# Altium project 28Pins_Arduino.PrjPcb
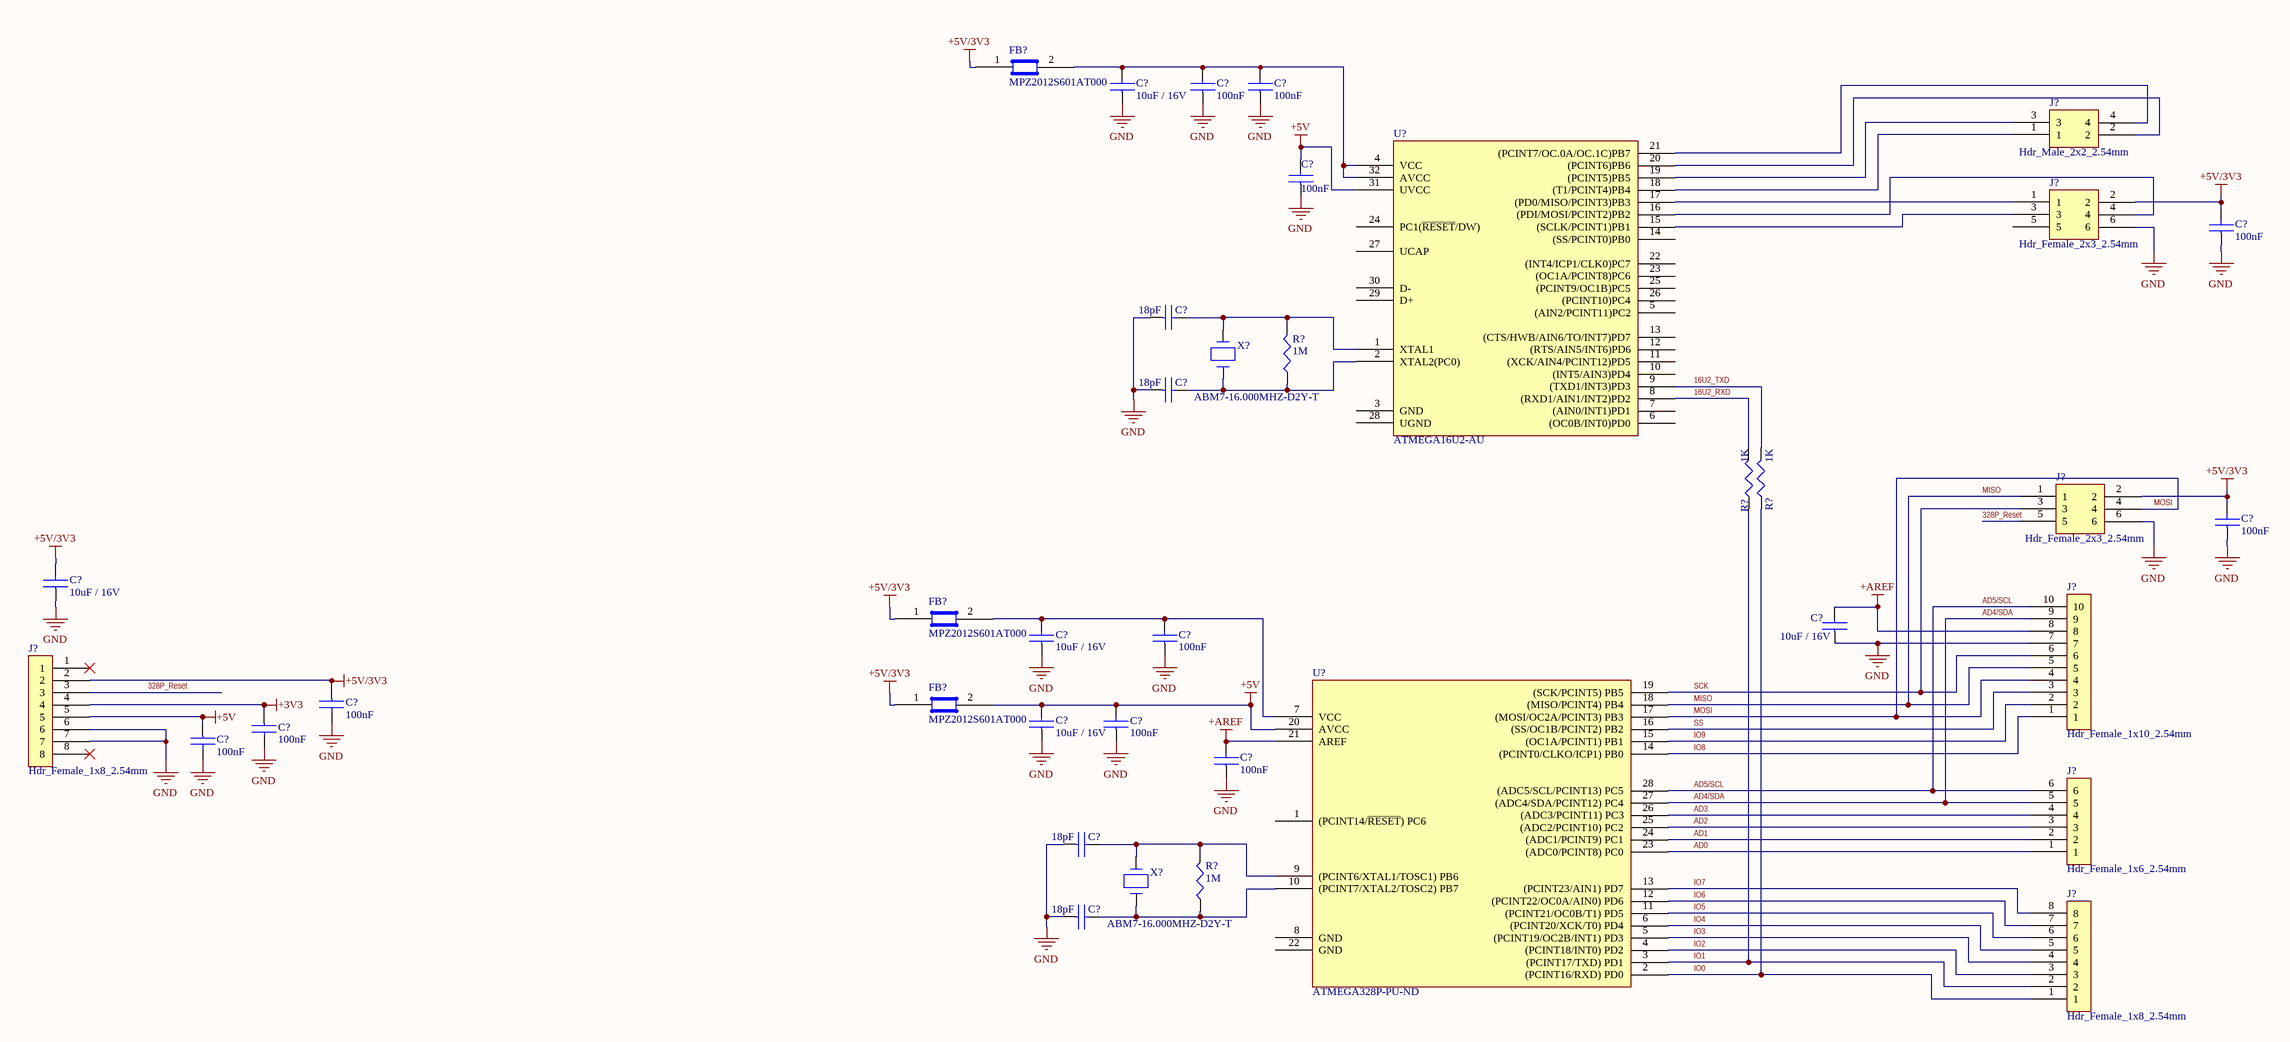
[diagram p0: 28Pins_Arduino_Schematic.SchDoc]
1 sheet, 38 parts. Net scope: global (net labels, ports and power ports of the same name join across sheets).
Board file: 28Pins_Arduino_PCB.PcbDoc

## Sheet 28Pins_Arduino_Schematic.SchDoc: 28-Pins
size A2; SheetNumber: 1; SheetTotal: 1

### Parts
(Parts that share a designator on the sheet are numbered #1, #2 ... from top to bottom, then left to right.)
C?#1  100nF  [C0805]
C?#2  100nF  [C0805]
C?#3  10uF / 16V  [C0805]
C?#4  100nF  [C0805]
C?#5  100nF  [C0805]
C?#6  18pF  [C0805]
C?#7  18pF  [C0805]
C?#8  100nF  [C0805]
C?#9  10uF / 16V  [C0805]
C?#10  100nF  [C0805]
C?#11  10uF / 16V  [C0805]
C?#12  10uF / 16V  [C0805]
C?#13  100nF  [C0805]
C?#14  100nF  [C0805]
C?#15  10uF / 16V  [C0805]
C?#16  100nF  [C0805]
C?#17  100nF  [C0805]
C?#18  100nF  [C0805]
C?#19  18pF  [C0805]
C?#20  18pF  [C0805]
FB?#1  MPZ2012S601AT000  [C0805]
FB?#2  MPZ2012S601AT000  [C0805]
FB?#3  MPZ2012S601AT000  [C0805]
J?#1  Hdr_Male_2x2_2.54mm  [Hdr_Male_2x2_2.54mm]
J?#2  Hdr_Female_2x3_2.54mm  [Hdr_Male_2x3_2.54mm]
J?#3  Hdr_Female_2x3_2.54mm  [Hdr_Male_2x3_2.54mm]
J?#4  Hdr_Female_1x8_2.54mm  [Hdr_Female_1x8_2.54mm]
J?#5  Hdr_Female_1x10_2.54mm  [Hdr_Female_1x10_2.54mm]
J?#6  Hdr_Female_1x6_2.54mm  [Hdr_Female_1x6_2.54mm]
J?#7  Hdr_Female_1x8_2.54mm  [Hdr_Female_1x8_2.54mm]
R?#1  1M  [R0805]
R?#2  1K  [R0805]
R?#3  1K  [R0805]
R?#4  1M  [R0805]
U?#1  ATMEGA16U2-AU  [32_TQFP_0.8mm]
U?#2  ATMEGA328P-PU-ND  [28_DIP_7.62mm]
X?#1  ABM7-16.000MHZ-D2Y-T  [ABM7_v1_1_Big]
X?#2  ABM7-16.000MHZ-D2Y-T  [ABM7_v1_1_Big]

### Nets
+3V3: C?#17.1 J?#4.4
+5V: C?#4.2 C?#13.2 C?#15.2 C?#18.1 FB?#3.2 J?#4.5 U?#1.31(UVCC) U?#2.20(AVCC)
+5V/3V3: C?#5.2 C?#8.2 C?#9.2 C?#14.1 FB?#1.1 FB?#2.1 FB?#3.1 J?#2.2 J?#3.2 J?#4.2
+AREF: C?#11.2 C?#16.2 J?#5.8 U?#2.21(AREF)
GND: C?#1.1 C?#2.1 C?#3.1 C?#4.1 C?#5.1 C?#6.1 C?#7.1 C?#8.1 C?#9.1 C?#10.1 C?#11.1 C?#12.1 C?#13.1 C?#14.2 C?#15.1 C?#16.1 C?#17.2 C?#18.2 C?#19.1 C?#20.1 J?#2.6 J?#3.6 J?#4.6 J?#4.7 J?#5.7
16U2_RXD: R?#2.2 U?#1.8((RXD1/AIN1/INT2)PD2)
16U2_TXD: R?#3.2 U?#1.9((TXD1/INT3)PD3)
328P_Reset: J?#3.5 J?#4.3
AD0: J?#6.1 U?#2.23((ADC0/PCINT8)_PC0)
AD1: J?#6.2 U?#2.24((ADC1/PCINT9)_PC1)
AD2: J?#6.3 U?#2.25((ADC2/PCINT10)_PC2)
AD3: J?#6.4 U?#2.26((ADC3/PCINT11)_PC3)
AD4/SDA: J?#5.9 J?#6.5 U?#2.27((ADC4/SDA/PCINT12)_PC4)
AD5/SCL: J?#5.10 J?#6.6 U?#2.28((ADC5/SCL/PCINT13)_PC5)
IO0: J?#7.1 R?#3.1 U?#2.2((PCINT16/RXD)_PD0)
IO1: J?#7.2 R?#2.1 U?#2.3((PCINT17/TXD)_PD1)
IO2: J?#7.3 U?#2.4((PCINT18/INT0)_PD2)
IO3: J?#7.4 U?#2.5((PCINT19/OC2B/INT1)_PD3)
IO4: J?#7.5 U?#2.6((PCINT20/XCK/T0)_PD4)
IO5: J?#7.6 U?#2.11((PCINT21/OC0B/T1)_PD5)
IO6: J?#7.7 U?#2.12((PCINT22/OC0A/AIN0)_PD6)
IO7: J?#7.8 U?#2.13((PCINT23/AIN1)_PD7)
IO8: J?#5.1 U?#2.14((PCINT0/CLKO/ICP1)_PB0)
IO9: J?#5.2 U?#2.15((OC1A/PCINT1)_PB1)
MISO: J?#3.1 J?#5.5 U?#2.18((MISO/PCINT4)_PB4)
MOSI: J?#3.4 J?#5.4 U?#2.17((MOSI/OC2A/PCINT3)_PB3)
SCK: J?#3.3 J?#5.6 U?#2.19((SCK/PCINT5)_PB5)
SS: J?#5.3 U?#2.16((SS/OC1B/PCINT2)_PB2)
NetC?#1_2: C?#1.2 C?#2.2 C?#3.2 FB?#1.2 U?#1.4(VCC) U?#1.32(AVCC)
NetC?#6_2: C?#6.2 R?#1.2 U?#1.1(XTAL1) X?#1.2
NetC?#7_2: C?#7.2 R?#1.1 U?#1.2(XTAL2(PC0)) X?#1.1
NetC?#10_2: C?#10.2 C?#12.2 FB?#2.2 U?#2.7(VCC)
NetC?#19_2: C?#19.2 R?#4.2 U?#2.9((PCINT6/XTAL1/TOSC1)_PB6) X?#2.2
NetC?#20_2: C?#20.2 R?#4.1 U?#2.10((PCINT7/XTAL2/TOSC2)_PB7) X?#2.1
NetJ?#1_1: J?#1.1 U?#1.18((T1/PCINT4)PB4)
NetJ?#1_2: J?#1.2 U?#1.20((PCINT6)PB6)
NetJ?#1_3: J?#1.3 U?#1.19((PCINT5)PB5)
NetJ?#1_4: J?#1.4 U?#1.21((PCINT7/OC.0A/OC.1C)PB7)
NetJ?#2_1: J?#2.1 U?#1.17((PD0/MISO/PCINT3)PB3)
NetJ?#2_3: J?#2.3 U?#1.15((SCLK/PCINT1)PB1)
NetJ?#2_4: J?#2.4 U?#1.16((PDI/MOSI/PCINT2)PB2)

Not connected (* = marked no-connect by the designer): J?#2 5; J?#4 1* 8*; U?#1 3(GND) 5((AIN2/PCINT11)PC2) 6((OC0B/INT0)PD0) 7((AIN0/INT1)PD1) 10((INT5/AIN3)PD4) 11((XCK/AIN4/PCINT12)PD5) 12((RTS/AIN5/INT6)PD6) 13((CTS/HWB/AIN6/TO/INT7)PD7) 14((SS/PCINT0)PB0) 22((INT4/ICP1/CLK0)PC7) 23((OC1A/PCINT8)PC6) 24(PC1(~{RESET}/DW)) 25((PCINT9/OC1B)PC5) 26((PCINT10)PC4) 27(UCAP) 28(UGND) 29(D+) 30(D-); U?#2 1((PCINT14/~{RESET})_PC6) 8(GND) 22(GND)

### Library data of the parts
C?#1 C?#2 C?#4 C?#5 C?#8 C?#10 C?#13 C?#14 C?#16-C?#18 = C2012X7R1H104K085AA: TDK - C2012X7R1H104K085AA - Keramikvielschichtkondensator, SMD, 0.1 µF, 50 V, 0805 [Metrisch 2012], ± 10%, X7R, C Series TDK; PCN Part Number: MLCC Part Number Change 30/Nov/2012; Product Training Modules: C Series General Applications SEAT, CCV, and TVCL Design Tools Guide to Replacing an Electrolytic Capacitor with an MLCC; Capacitance: 0.1µF; Voltage - Rated: 50V; Online Catalog: C Series, General Purpose; Kits: 445-9015-KIT-ND  - KIT MLCC 1000PF-47UF 0805 10-50V; Other Names: 445-7534-1; Supplier 1: Digi-Key; Manufacturer: TDK; Manufacturer Part Number: C2012X7R1H104K085AA; Stock 1: 307688; Pricing 1: 1=0.17, 10=0.119, 100=0.0561, 500=0.0394, 1000=0.0326 (USD); RoHS Information: RoHS Certificate-MLCC; Standard Package: 1; Category: Capacitors; Family: Ceramic Capacitors; Series: C; Packaging: Cut Tape (CT); Tolerance: ±10%; Temperature Coefficient: X7R; Mounting Type: Surface Mount, MLCC; Operating Temperature: -55°C ~ 125°C; Applications: General Purpose; Ratings: -; Package / Case: 0805 (2012 Metric); Size / Dimension: 0.079" L x 0.049" W (2.00mm x 1.25mm); Height - Seated (Max): -; Thickness (Max): 0.037" (0.95mm); Lead Spacing: -; Features: -; Lead Style: -; ComponentLink1URL: http://uk.rs-online.com/webdocs/1532/0900766b81532cd0.pdf?src-supplier=RSComponents; ComponentLink1Description: http://uk.rs-online.com/webdocs/1532/0900766b81532cd0.pdf?src-supplier=RSComponents; ComponentLink2URL: https://product.tdk.com/info/en/catalog/datasheets/mlcc_commercial_general_en.pdf?src-supplier=Digi-Key; ComponentLink2Description: https://product.tdk.com/info/en/catalog/datasheets/mlcc_commercial_general_en.pdf?src-supplier=Digi-Key; ComponentLink3URL: http://www.tdk.co.jp/tefe02/e412_c.pdf?src-supplier=Future+Electronics; ComponentLink3Description: http://www.tdk.co.jp/tefe02/e412_c.pdf?src-supplier=Future+Electronics; ComponentLink4URL: http://www.farnell.com/datasheets/1796654.pdf?src-supplier=Newark; ComponentLink4Description: http://www.farnell.com/datasheets/1796654.pdf?src-supplier=Newark; ComponentLink5URL: http://www.farnell.com/datasheets/1571323.pdf?src-supplier=Element14; ComponentLink5Description: http://www.farnell.com/datasheets/1571323.pdf?src-supplier=Element14; Supplier Part Number 1: 445-7534-1-ND
C?#3 C?#9 C?#11 C?#12 C?#15 = C2012X5R1C106M125AC: CERAMIC CAPACITOR, 10UF, 16V, X5R, 20%, 0805, FULL REEL; Product Range:C Series; Capacitance:10 F; Capacitance Tolerance: 20%; Dielectric Characteristic:X5R; Voltage Rating:16V; Ceramic Capacitor Case:0805 [2012 Metric]; MSL:- ;RoHS Compliant: Yes; Manufacturer: TDK; PCN Part Number: MLCC Part Number Change 30/Nov/2012; Product Training Modules: C Series General Applications SEAT, CCV, and TVCL Design Tools Guide to Replacing an Electrolytic Capacitor with an MLCC; Catalog Drawings: C SERIES_2012-0805_1.45; Capacitance: 10µF; Online Catalog: C Series, General Purpose; Other Names: 445-4115-2 C2012X5R1C106M C2012X5R1C106M/1.25 C2012X5R1C106MT C2012X5R1C106MTJ00E; Supplier 1: Digi-Key; Manufacturer Part Number: C2012X5R1C106M125AC; Stock 1: 0; RoHS Information: RoHS Certificate-MLCC; Standard Package: 2,000; Category: Capacitors; Family: Ceramic Capacitors; Series: C; Packaging: Tape & Reel (TR); Tolerance: ±20%; Voltage - Rated: 16V; Temperature Coefficient: X5R; Mounting Type: Surface Mount, MLCC; Operating Temperature: -55°C ~ 85°C; Applications: General Purpose; Ratings: -; Package / Case: 0805 (2012 Metric); Size / Dimension: 0.079" L x 0.049" W (2.00mm x 1.25mm); Height - Seated (Max): -; Thickness (Max): 0.057" (1.45mm); Lead Spacing: -; Features: -; Lead Style: -; ComponentLink1URL: https://media.digikey.com/pdf/Data%20Sheets/TDK%20PDFs/Multilayer%20Ceramic%20Chip%20Cap(up%20to%2050V).pdf?src-supplier=Digi-Key; ComponentLink1Description: https://media.digikey.com/pdf/Data%20Sheets/TDK%20PDFs/Multilayer%20Ceramic%20Chip%20Cap(up%20to%2050V).pdf?src-supplier=Digi-Key; ComponentLink2URL: http://www.farnell.com/datasheets/1913358.pdf?src-supplier=Element14; ComponentLink2Description: http://www.farnell.com/datasheets/1913358.pdf?src-supplier=Element14; ComponentLink3URL: https://product.tdk.com/info/en/documents/chara_sheet/C2012X5R1C106M125AC.pdf?src-supplier=Newark; ComponentLink3Description: https://product.tdk.com/info/en/documents/chara_sheet/C2012X5R1C106M125AC.pdf?src-supplier=Newark; Supplier Part Number 1: 445-4115-2-ND
C?#6 C?#7 C?#19 C?#20 = C0805C180K5GACTU: KEMET - C0805C180K5GACTU - SMD Multilayer Ceramic Capacitor, 18 pF, 50 V, 0805 [2012 Metric], ± 10%, C0G / NP0, C Series KEMET; Part # Aliases: C0805C180K5GAC7800; Case Height: 0.78 mm; Case Length: 2 mm; Dielectric: C0G (NP0); Case Width: 1.2 mm; Class: Class 1; Dissipation Factor DF: 0.1; Voltage Rating: 50 V; Temperature Coefficient / Code: +/- 30 PPM / C; Type: SMD MLCC C0G 10 - 250 VDC Commercial Grade; Supplier 1: Digi-Key; Manufacturer: KEMET; Manufacturer Part Number: C0805C180K5GACTU; Stock 1: 42877; Pricing 1: 1=0.12, 10=0.09, 100=0.0403, 500=0.0288, 1000=0.0226 (USD); Brand: Kemet; Capacitance: 18 pF; Case Code - in: 0805; Case Code - mm: 2012; Dimensions: 1.2 mm W x 2 mm L x 0.78 mm H; Lead Spacing: 0.75 mm; Factory Pack Quantity: 4000; Product Category: Multilayer Ceramic Capacitors MLCC - SMD/SMT; RoHS: Details; Voltage Rating DC: 50 V; Tolerance: 10 %; Minimum Operating Temperature: - 55 C; Maximum Operating Temperature: + 125 C; Product: General Type MLCCs; Operating Temperature Range: - 55 C to + 125 C; Package / Case: 0805 (2012 metric); Packaging: Reel; Series: C0805C; Termination Style: SMD/SMT; ComponentLink1URL: https://www.verical.com/server-webapp/html/getDatasheet?partID=742486&src-supplier=Verical; ComponentLink1Description: https://www.verical.com/server-webapp/html/getDatasheet?partID=742486&src-supplier=Verical; ComponentLink2URL: http://www.mouser.com/ds/2/212/KEM_C1003_C0G_SMD-1101588.pdf?src-supplier=Mouser; ComponentLink2Description: http://www.mouser.com/ds/2/212/KEM_C1003_C0G_SMD-1101588.pdf?src-supplier=Mouser; Supplier Part Number 1: 399-8030-1-ND
FB?#1-FB?#3 = MPZ2012S601AT000: FERRITE BEAD 600 OHM 0805 1LN; Manufacturer: TDK; PCN Part Number: MMZ,MPS Series Oct/2014; Product Training Modules: EMC Components; Catalog Drawings: (MMZ,MPZ)2012 Series Top / (MMZ,MPZ)2012 Series Footprint / (MMZ,MPZ)2012 Series Side; Impedance @ Frequency: 600 Ohm @ 100MHz; Current Rating: 2A; DC Resistance (DCR): 100 mOhm Max; Filter Type: Differential Mode - Single; Online Catalog: MPZ2012 Series; Other Names: 445-2206-6; Supplier 1: Digi-Key; Manufacturer Part Number: MPZ2012S601AT000; Stock 1: 133386; Pricing 1: 1=0.11, 10=0.091, 25=0.0704, 50=0.0584, 100=0.0503, 250=0.0403, 500=0.0362, 1000=0.0302 (USD); Standard Package: 1; Category: Filters; Family: Ferrite Beads and Chips; Series: MPZ; Packaging: Digi-Reel®; Package / Case: 0805 (2012 Metric); Mounting Type: Surface Mount; Height (Max): 0.041" (1.05mm); Size / Dimension: 0.079" L x 0.049" W (2.00mm x 1.25mm); ComponentLink1URL: https://media.digikey.com/pdf/Data%20Sheets/TDK%20PDFs/MPZ_Series_Br.pdf?src-supplier=Digi-Key; ComponentLink1Description: https://media.digikey.com/pdf/Data%20Sheets/TDK%20PDFs/MPZ_Series_Br.pdf?src-supplier=Digi-Key; ComponentLink2URL: https://product.tdk.com/info/en/catalog/datasheets/beads_commercial_power_mpz2012_en.pdf?src-supplier=Digi-Key; ComponentLink2Description: https://product.tdk.com/info/en/catalog/datasheets/beads_commercial_power_mpz2012_en.pdf?src-supplier=Digi-Key; Supplier Part Number 1: 445-2206-6-ND
J?#1 = Hdr_Male_2x2_2.54mm - M20-9760246: 2 x 2 male header; Manufacturer: Harwin; Number of Positions / Contacts: 4; Pitch: 2.54 mm; Mounting Angle: Vertical; Current Rating: 3 A; Voltage Rating: 750 V; Description: 02+02 DIL Vert Pin Hdr; Supplier 1: Digi-Key; Manufacturer Part Number: M20-9760246; Stock 1: 8632; Pricing 1: 1=0.19, 10=0.179, 100=0.1102, 500=0.0912, 1000=0.0798, 5000=0.0684, 10000=0.0665 (USD); Mounting Style: Panel; Product Category: Headers & Wire Housings; RoHS: Details; Brand: Harwin; Series: M20; Product Type: Headers; Type: Pin Strip; Number of Positions: 4; Number of Rows: 2; Contact Plating: Tin; Housing Material: Nylon; Termination Style: Through Hole; Factory Pack Quantity: 1000; ComponentLink1URL: https://cdn.harwin.com/pdfs/Harwin_PC_Connectors_M20.pdf?src-supplier=Digi-Key; ComponentLink1Description: https://cdn.harwin.com/pdfs/Harwin_PC_Connectors_M20.pdf?src-supplier=Digi-Key; ComponentLink2URL: http://components.arrow.com/part/dataview/0323_00724419?src-supplier=Arrow+Europe; ComponentLink2Description: http://components.arrow.com/part/dataview/0323_00724419?src-supplier=Arrow+Europe; ComponentLink3URL: http://www.mouser.com/ds/2/181/Harwin_Product_Catalog_page_207-1131241.pdf?src-supplier=Mouser; ComponentLink3Description: http://www.mouser.com/ds/2/181/Harwin_Product_Catalog_page_207-1131241.pdf?src-supplier=Mouser; Supplier Part Number 1: 952-1772-ND
J?#2 J?#3 = Hdr_Female_2x3_2.54mm - M20-9760346: 2 x 3 male header; Manufacturer: Harwin; Number of Positions / Contacts: 6; Pitch: 2.54 mm; Mounting Angle: Vertical; Current Rating: 3 A; Voltage Rating: 750 V; Supplier 1: Digi-Key; Manufacturer Part Number: M20-9760346; Stock 1: 3112; Pricing 1: 1=0.24, 10=0.221, 100=0.1534, 500=0.1298, 1000=0.1062, 5000=0.0944, 10000=0.0856 (USD); Mounting Style: Panel; Product Category: Headers & Wire Housings; RoHS: Details; Brand: Harwin; Series: M20; Product Type: Headers; Type: Pin Strip; Number of Positions: 6; Number of Rows: 2; Housing Material: Nylon; Termination Style: Through Hole; Factory Pack Quantity: 1000; ComponentLink1URL: https://cdn.harwin.com/pdfs/Harwin_PC_Connectors_M20.pdf?src-supplier=Digi-Key; ComponentLink1Description: https://cdn.harwin.com/pdfs/Harwin_PC_Connectors_M20.pdf?src-supplier=Digi-Key; Supplier Part Number 1: 952-1779-ND
J?#4 J?#7 = Hdr_Female_1x8_2.54mm - M20-7820842: 2.54mm (0.1") Pitch SIL Vertical PC Tail Socket Assembly, selective gold + tin, 8 contacts; Manufacturer: Harwin; Rad Hard: No; Number of Contacts: 8; Gender: SKT; Supplier 1: Digi-Key; Manufacturer Part Number: M20-7820842; Stock 1: 0; Pricing 1: 1=1.1, 10=0.972, 100=0.8382, 500=0.6858, 1000=0.6096, 5000=0.5334, 10000=0.5067 (USD); Type: Socket Strip; Pitch: 2.54 mm; Number of Rows: 1; Contact Plating: Gold; Termination Method: Solder; Category: Connector Headers and PCB Receptacles; ComponentLink1URL: https://cdn.harwin.com/pdfs/Harwin_PC_Connectors_M20.pdf?src-supplier=Avnet+Europe; ComponentLink1Description: https://cdn.harwin.com/pdfs/Harwin_PC_Connectors_M20.pdf?src-supplier=Avnet+Europe; ComponentLink2URL: http://www.harwin.com/include/downloads/drawings/M20-782.PDF?src-supplier=Avnet; ComponentLink2Description: http://www.harwin.com/include/downloads/drawings/M20-782.PDF?src-supplier=Avnet; Supplier Part Number 1: 952-1823-ND
J?#5 = Hdr_Female_1x10_2.54mm - M20-7821046: HARWIN - M20-7821046 - Board-To-Board Connector, M20 Series, Through Hole, Receptacle, 10, 2.54 mm, Tin Plated Contacts; Number of Contacts: 10; Pitch: 2.54mm; Body Orientation: Straight; Current Rating: 3A; Supplier 1: Digi-Key; Manufacturer: Harwin; Manufacturer Part Number: M20-7821046; Stock 1: 499; Pricing 1: 1=1.28, 10=1.122, 100=0.968, 500=0.792, 1000=0.704, 5000=0.616, 10000=0.5852 (USD); Number of Rows: 1; Type: Socket Strip; Mounting Type: Through Hole; Termination Method: Solder; Contact Material: Phosphor Bronze; ComponentLink1URL: https://www.verical.com/server-webapp/html/getDatasheet?partID=559226&src-supplier=Verical; ComponentLink1Description: https://www.verical.com/server-webapp/html/getDatasheet?partID=559226&src-supplier=Verical; ComponentLink2URL: https://cdn.harwin.com/pdfs/M20-782.pdf?src-supplier=Digi-Key; ComponentLink2Description: https://cdn.harwin.com/pdfs/M20-782.pdf?src-supplier=Digi-Key; ComponentLink3URL: http://www.harwin.com/include/downloads/drawings/M20-782.PDF?src-supplier=Avnet; ComponentLink3Description: http://www.harwin.com/include/downloads/drawings/M20-782.PDF?src-supplier=Avnet; ComponentLink4URL: https://cdn.harwin.com/pdfs/Harwin_PC_Connectors_M20.pdf?src-supplier=Avnet+Europe; ComponentLink4Description: https://cdn.harwin.com/pdfs/Harwin_PC_Connectors_M20.pdf?src-supplier=Avnet+Europe; ComponentLink5URL: http://uk.rs-online.com/webdocs/1422/0900766b81422659.pdf?src-supplier=RSComponents; ComponentLink5Description: http://uk.rs-online.com/webdocs/1422/0900766b81422659.pdf?src-supplier=RSComponents; Supplier Part Number 1: 952-1847-ND
J?#6 = Hdr_Female_1x6_2.54mm - M20-7820646: 06-WAY SIL VERT SOCKET L/FREE; Manufacturer: Harwin; Rad Hard: No; Pitch: 2.54 mm; Number of Contacts: 6; Gender: SKT; Supplier 1: Digi-Key; Manufacturer Part Number: M20-7820646; Stock 1: 1368; Pricing 1: 1=0.96, 10=0.842, 100=0.726, 500=0.594, 1000=0.528, 5000=0.462, 10000=0.4389 (USD); Contact Plating: Tin; Type: Socket Strip; Number of Rows: 1; Termination Method: Solder; Category: Connector Headers and PCB Receptacles; ComponentLink1URL: http://www.harwin.com/include/downloads/pdfs/2010PAGE120.PDF?src-supplier=Avnet; ComponentLink1Description: http://www.harwin.com/include/downloads/pdfs/2010PAGE120.PDF?src-supplier=Avnet; ComponentLink2URL: https://cdn.harwin.com/pdfs/M20-782.pdf?src-supplier=Digi-Key; ComponentLink2Description: https://cdn.harwin.com/pdfs/M20-782.pdf?src-supplier=Digi-Key; ComponentLink3URL: http://components.arrow.com/part/dataview/0323_00725884?src-supplier=Arrow+Europe; ComponentLink3Description: http://components.arrow.com/part/dataview/0323_00725884?src-supplier=Arrow+Europe; ComponentLink4URL: https://cdn.harwin.com/pdfs/Harwin_PC_Connectors_M20.pdf?src-supplier=Avnet+Europe; ComponentLink4Description: https://cdn.harwin.com/pdfs/Harwin_PC_Connectors_M20.pdf?src-supplier=Avnet+Europe; ComponentLink5URL: https://cdn.harwin.com/pdfs/Harwin_PC_Connectors_M20.pdf?src-supplier=Mouser; ComponentLink5Description: https://cdn.harwin.com/pdfs/Harwin_PC_Connectors_M20.pdf?src-supplier=Mouser; ComponentLink6URL: https://cdn.harwin.com/pdfs/Harwin_PC_Connectors_M20.pdf?src-supplier=RSComponents; ComponentLink6Description: https://cdn.harwin.com/pdfs/Harwin_PC_Connectors_M20.pdf?src-supplier=RSComponents; ComponentLink7URL: https://cdn.harwin.com/pdfs/Harwin_PC_Connectors_M20.pdf?src-supplier=TTI; ComponentLink7Description: https://cdn.harwin.com/pdfs/Harwin_PC_Connectors_M20.pdf?src-supplier=TTI; Supplier Part Number 1: 952-1809-ND
R?#1 R?#4 = RC0805FR-071ML: RES SMD 1M OHM 1% 1/8W 0805; Manufacturer: Yageo; Resistance: 1 MOhms; Power Rating: 125 mW (1/8 W); Voltage Rating: 150 V; Temperature Coefficient: 100 PPM / C; Supplier 1: Digi-Key; Manufacturer Part Number: RC0805FR-071ML; Stock 1: 3798458; Pricing 1: 1=0.1, 10=0.04, 100=0.0163, 1000=0.0073, 2500=0.0064 (USD); Termination Style: SMD/SMT; Product: Thick Film Resistors General Purpose; Tolerance: 1 %; Case Code - in: 0805; Case Code - mm: 2012; Series: RC; Operating Temperature Range: - 55 C to + 155 C; Packaging: Reel; ComponentLink1URL: http://www.yageo.com/documents/recent/PYu-RC_Group_51_RoHS_L_10.pdf?src-supplier=Digi-Key; ComponentLink1Description: http://www.yageo.com/documents/recent/PYu-RC_Group_51_RoHS_L_10.pdf?src-supplier=Digi-Key; ComponentLink2URL: http://www.yageo.ru/pdf/RC0805.pdf?src-supplier=Future+Electronics; ComponentLink2Description: http://www.yageo.ru/pdf/RC0805.pdf?src-supplier=Future+Electronics; ComponentLink3URL: http://www.yageo.com/documents/recent/PYu-RC_Group_51_RoHS_L_9.pdf?src-supplier=Mouser; ComponentLink3Description: http://www.yageo.com/documents/recent/PYu-RC_Group_51_RoHS_L_9.pdf?src-supplier=Mouser; Supplier Part Number 1: 311-1.00MCRCT-ND
R?#2 R?#3 = RC0805FR-071KL: RES SMD 1K OHM 1% 1/8W 0805; Manufacturer: Yageo Phycomp; Supplier 1: Digi-Key; Manufacturer Part Number: RC0805FR-071KL; Stock 1: 20942477; Pricing 1: 1=0.1, 10=0.04, 100=0.0163, 1000=0.0073, 2500=0.0064 (USD); Supplier Part Number 1: 311-1.00KCRCT-ND
U?#1 = ATMEGA16U2-AU: MCU 8-bit ATmega AVR RISC 16KB Flash 3.3V/5V 32-Pin TQFP; Manufacturer: Microchip; Categories: Integrated Circuits (ICs); Speed: 16MHz; Connectivity: SPI, UART/USART, USB; Peripherals: Brown-out Detect/Reset, POR, PWM, WDT; Number of I/O: 22; Program Memory Size: 16KB (8K x 16); EEPROM Size: 512 x 8; Voltage - Supply (Vcc/Vdd): 2.7V ~ 5.5V; Oscillator Type: Internal; Supplier 1: Digi-Key; Manufacturer Part Number: ATMEGA16U2-AU; Stock 1: 1544; Pricing 1: 1=2.45, 25=2.25, 100=2.04 (USD); Series: AVR® ATmega; Packaging: Tray; Part Status: Active; Core Processor: AVR; Core Size: 8-Bit; Program Memory Type: FLASH; RAM Size: 512 x 8; Data Converters: -; Operating Temperature: -40°C ~ 85°C (TA); Package / Case: 32-TQFP; Supplier Device Package: 32-TQFP (7x7); Base Part Number: ATMEGA16U2; Supplier Part Number 1: ATMEGA16U2-AU-ND
U?#2 = ATMEGA328P-PU: ATMEGA328P-PU; 8 bit Microcontroller AVR 20MHz 1; 32kb Flash; 2kb RAM; I2C SPI 2; Manufacturer: Microchip / Atmel; Manuf. Code: ATM; Series (embedded microcontroller): AVR® ATmega; Core size: 8-Bit; Oscillator type: Internal; Peripherals: Brown-out Detect/Reset, POR, PWM, WDT; I/O number: 23; Supply voltage (max.): 5.5 V; Supply voltage (min.): 1.8 V; Data converter (embedded microcontroller): A/D 6x10b; EEPROM size: 1 K x 8; Connectivity: I²C, SPI, UART/USART; Program memory size: 32 KB (16 K x 16); RAM size: 2 K x 8; Casing: PDIP 28; Supplier 1: Digi-Key; Manufacturer Part Number: ATMEGA328P-PU; Stock 1: 1458; Pricing 1: 1=2.08, 25=1.91, 100=1.73 (USD); Type: ATMEGA328P-PU; Clock speed: 20 MHz; Processor core: AVR; Program memory type: FLASH; Max. operating temperature: +85 °C; Operating temperature (min.): -40 °C; ComponentLink1URL: http://www.farnell.com/datasheets/2047852.pdf?src-supplier=Element14; ComponentLink1Description: http://www.farnell.com/datasheets/2047852.pdf?src-supplier=Element14; ComponentLink2URL: http://www.rapidonline.com/pdf/73-4283.pdf?src-supplier=Rapid+Electronics; ComponentLink2Description: http://www.rapidonline.com/pdf/73-4283.pdf?src-supplier=Rapid+Electronics; ComponentLink3URL: http://www.microchip.com/mymicrochip/filehandler.aspx?ddocname=en589968&src-supplier=Verical; ComponentLink3Description: http://www.microchip.com/mymicrochip/filehandler.aspx?ddocname=en589968&src-supplier=Verical; ComponentLink4URL: http://www.microchip.com/mymicrochip/filehandler.aspx?ddocname=en589968&src-supplier=Jameco; ComponentLink4Description: http://www.microchip.com/mymicrochip/filehandler.aspx?ddocname=en589968&src-supplier=Jameco; ComponentLink5URL: http://datasheet.iiic.cc/atmel/ATMEGA328P-PU.pdf?src-supplier=IIIC; ComponentLink5Description: http://datasheet.iiic.cc/atmel/ATMEGA328P-PU.pdf?src-supplier=IIIC; ComponentLink6URL: http://www.produktinfo.conrad.com/datenblaetter/150000-174999/155197-da-01-en-MICROCONTR_ATMEGA328P_PU_8BIT_PDIP_28.pdf?src-supplier=Conrad; ComponentLink6Description: http://www.produktinfo.conrad.com/datenblaetter/150000-174999/155197-da-01-en-MICROCONTR_ATMEGA328P_PU_8BIT_PDIP_28.pdf?src-supplier=Conrad; Supplier Part Number 1: ATMEGA328P-PU-ND
X?#1 X?#2 = ABM7-16.000MHZ-D2Y-T: CRYSTAL 16.0000MHZ 18PF SMD; Manufacturer: Abracon; Catalog Drawings: ABM7 Series Top / ABM7 Series Side / ABM7 Series Bottom; Featured Product: ABM7 and ABM11 Crystals; 3D Model: ABM7.pdf / ABM7.stp; Frequency: 16MHz; Frequency Stability: ±30ppm; Frequency Tolerance: ±20ppm; ESR (Equivalent Series Resistance): 50 Ohm; Operating Mode: Fundamental; Online Catalog: ABM7 Series; Other Names: 535-9840-2 / ABM7-16.000MHZ-D-2-Y-T / ABM716000MHZD2YT; Supplier 1: Digi-Key; Manufacturer Part Number: ABM7-16.000MHZ-D2Y-T; Stock 1: 66828; Pricing 1: 1=1, 10=0.886, 50=0.8278, 100=0.7315, 500=0.693 (USD); RoHS Information: RoHS2/REACH Compliance; Standard Package: 1,000; Category: Crystals and Oscillators; Family: Crystals; Series: ABM7; Packaging: Tape & Reel (TR); Type: MHz Crystal; Load Capacitance: 18pF; Operating Temperature: -40°C ~ 85°C; Mounting Type: Surface Mount; Package / Case: 2-SMD; Size / Dimension: 0.236" L x 0.138" W (6.00mm x 3.50mm); Height: 0.055" (1.40mm); ComponentLink1URL: https://www.verical.com/server-webapp/html/getDatasheet?partID=721624&src-supplier=Verical; ComponentLink1Description: https://www.verical.com/server-webapp/html/getDatasheet?partID=721624&src-supplier=Verical; ComponentLink2URL: http://www.farnell.com/datasheets/947971.pdf?src-supplier=Element14; ComponentLink2Description: http://www.farnell.com/datasheets/947971.pdf?src-supplier=Element14; ComponentLink3URL: http://www.abracon.com/Resonators/abm7.pdf?src-supplier=Farnell; ComponentLink3Description: http://www.abracon.com/Resonators/abm7.pdf?src-supplier=Farnell; ComponentLink4URL: http://www.abracon.com/Resonators/abm7.pdf?src-supplier=Future+Electronics; ComponentLink4Description: http://www.abracon.com/Resonators/abm7.pdf?src-supplier=Future+Electronics; ComponentLink5URL: https://abracon.com/Resonators/abm7.pdf?src-supplier=Digi-Key; ComponentLink5Description: https://abracon.com/Resonators/abm7.pdf?src-supplier=Digi-Key; ComponentLink6URL: http://www.abracon.com/Support/PackageDrawing/Resonators/ABM7.PDF?src-supplier=Verical; ComponentLink6Description: http://www.abracon.com/Support/PackageDrawing/Resonators/ABM7.PDF?src-supplier=Verical; Supplier Part Number 1: 535-9840-6-ND